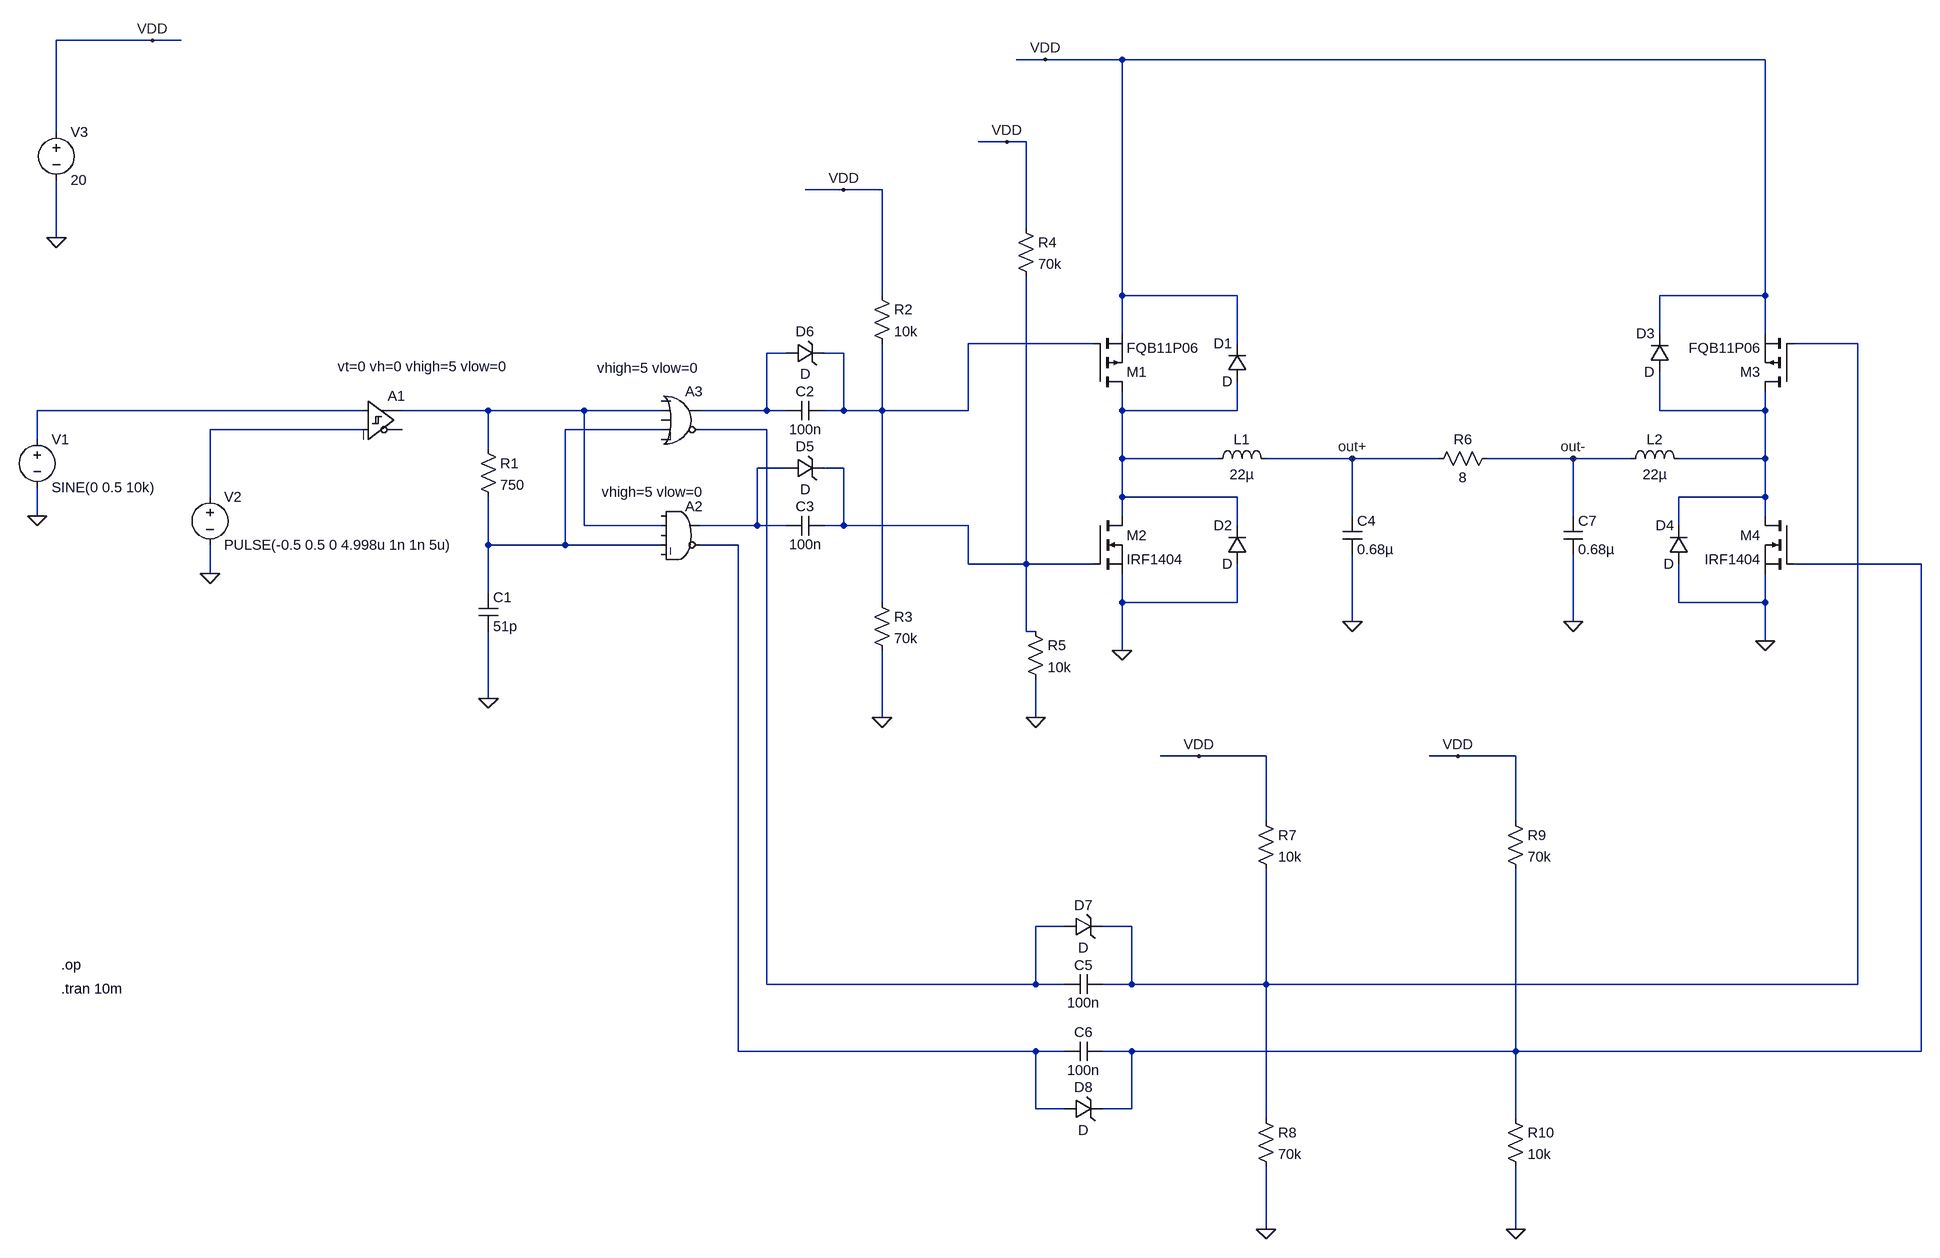
[diagram p0: schematic ClassDAmplifierFullWithProtection.asc]
ClassDAmplifierFullWithProtection.asc, the LTspice schematic file:
Version 4
SHEET 1 1620 1204
WIRE -1440 -880 -1600 -880
WIRE -1392 -880 -1440 -880
WIRE 48 -848 0 -848
WIRE 176 -848 48 -848
WIRE 1248 -848 176 -848
WIRE -1600 -720 -1600 -880
WIRE -16 -704 -64 -704
WIRE 16 -704 -16 -704
WIRE -288 -624 -352 -624
WIRE -224 -624 -288 -624
WIRE 16 -560 16 -704
WIRE -1600 -544 -1600 -640
WIRE -224 -448 -224 -624
WIRE 176 -448 176 -848
WIRE 368 -448 176 -448
WIRE 1248 -448 1248 -848
WIRE 1248 -448 1072 -448
WIRE 176 -384 176 -448
WIRE 1072 -384 1072 -448
WIRE 1248 -384 1248 -448
WIRE 128 -368 -80 -368
WIRE 368 -368 368 -448
WIRE 1504 -368 1296 -368
WIRE -384 -352 -416 -352
WIRE -288 -352 -320 -352
WIRE -1088 -256 -1632 -256
WIRE -880 -256 -1024 -256
WIRE -720 -256 -880 -256
WIRE -592 -256 -720 -256
WIRE -416 -256 -416 -352
WIRE -416 -256 -528 -256
WIRE -384 -256 -416 -256
WIRE -288 -256 -288 -352
WIRE -288 -256 -320 -256
WIRE -224 -256 -224 -368
WIRE -224 -256 -288 -256
WIRE -80 -256 -80 -368
WIRE -80 -256 -224 -256
WIRE 176 -256 176 -288
WIRE 368 -256 368 -304
WIRE 368 -256 176 -256
WIRE 1072 -256 1072 -320
WIRE 1248 -256 1248 -288
WIRE 1248 -256 1072 -256
WIRE -1088 -224 -1344 -224
WIRE -592 -224 -752 -224
WIRE -416 -224 -528 -224
WIRE -1632 -208 -1632 -256
WIRE -880 -192 -880 -256
WIRE 176 -176 176 -256
WIRE 336 -176 176 -176
WIRE 560 -176 416 -176
WIRE 704 -176 560 -176
WIRE 928 -176 784 -176
WIRE 1024 -176 928 -176
WIRE 1248 -176 1248 -256
WIRE 1248 -176 1104 -176
WIRE -384 -160 -432 -160
WIRE -288 -160 -320 -160
WIRE -1344 -112 -1344 -224
WIRE 176 -112 176 -176
WIRE 368 -112 176 -112
WIRE 1248 -112 1248 -176
WIRE 1248 -112 1104 -112
WIRE -1632 -80 -1632 -128
WIRE 176 -80 176 -112
WIRE 560 -80 560 -176
WIRE 928 -80 928 -176
WIRE 1248 -80 1248 -112
WIRE -720 -64 -720 -256
WIRE -592 -64 -720 -64
WIRE -432 -64 -432 -160
WIRE -432 -64 -528 -64
WIRE -384 -64 -432 -64
WIRE -288 -64 -288 -160
WIRE -288 -64 -320 -64
WIRE -80 -64 -288 -64
WIRE 368 -64 368 -112
WIRE 1104 -64 1104 -112
WIRE -880 -32 -880 -112
WIRE -752 -32 -752 -224
WIRE -752 -32 -880 -32
WIRE -592 -32 -752 -32
WIRE -464 -32 -528 -32
WIRE -80 0 -80 -64
WIRE 16 0 16 -480
WIRE 16 0 -80 0
WIRE 128 0 16 0
WIRE 1616 0 1296 0
WIRE -1344 16 -1344 -32
WIRE -880 48 -880 -32
WIRE -224 64 -224 -256
WIRE 176 64 176 16
WIRE 368 64 368 0
WIRE 368 64 176 64
WIRE 1104 64 1104 0
WIRE 1248 64 1248 16
WIRE 1248 64 1104 64
WIRE 560 96 560 -16
WIRE 928 96 928 -16
WIRE 16 112 16 0
WIRE 32 112 16 112
WIRE 1248 128 1248 64
WIRE 176 144 176 64
WIRE -880 224 -880 112
WIRE -224 256 -224 144
WIRE 32 256 32 192
WIRE 304 320 240 320
WIRE 416 320 304 320
WIRE 736 320 688 320
WIRE 832 320 736 320
WIRE 416 480 416 320
WIRE 832 480 832 320
WIRE 80 656 32 656
WIRE 192 656 144 656
WIRE -416 752 -416 -224
WIRE 32 752 32 656
WIRE 32 752 -416 752
WIRE 80 752 32 752
WIRE 192 752 192 656
WIRE 192 752 144 752
WIRE 416 752 416 560
WIRE 416 752 192 752
WIRE 1504 752 1504 -368
WIRE 1504 752 416 752
WIRE -464 864 -464 -32
WIRE 32 864 -464 864
WIRE 80 864 32 864
WIRE 192 864 144 864
WIRE 832 864 832 560
WIRE 832 864 192 864
WIRE 1616 864 1616 0
WIRE 1616 864 832 864
WIRE 32 960 32 864
WIRE 80 960 32 960
WIRE 192 960 192 864
WIRE 192 960 144 960
WIRE 416 976 416 752
WIRE 832 976 832 864
WIRE 416 1184 416 1056
WIRE 832 1184 832 1056
FLAG -1344 16 0
FLAG -1632 -80 0
FLAG -880 224 0
FLAG -1600 -544 0
FLAG -1440 -880 VDD
FLAG 176 144 0
FLAG 48 -848 VDD
FLAG 32 256 0
FLAG -224 256 0
FLAG -288 -624 VDD
FLAG -16 -704 VDD
FLAG 560 96 0
FLAG 928 96 0
FLAG 1248 128 0
FLAG 416 1184 0
FLAG 832 1184 0
FLAG 304 320 VDD
FLAG 736 320 VDD
FLAG 560 -176 out+
FLAG 928 -176 out-
SYMBOL Digital\\diffschmitt -1088 -304 R0
WINDOW 3 -43 -25 Left 2
SYMATTR Value vt=0 vh=0 vhigh=5 vlow=0
SYMATTR InstName A1
SYMBOL voltage -1632 -224 R0
WINDOW 123 0 0 Left 0
WINDOW 39 0 0 Left 0
SYMATTR InstName V1
SYMATTR Value SINE(0 0.5 10k)
SYMBOL voltage -1344 -128 R0
WINDOW 123 0 0 Left 0
WINDOW 39 0 0 Left 0
SYMATTR InstName V2
SYMATTR Value PULSE(-0.5 0.5 0 4.998u 1n 1n 5u)
SYMBOL Digital\\and -560 -112 R0
WINDOW 3 -131 -8 Left 2
SYMATTR Value vhigh=5 vlow=0
SYMATTR InstName A2
SYMBOL Digital\\or -560 -304 R0
WINDOW 3 -139 -23 Left 2
SYMATTR Value vhigh=5 vlow=0
SYMATTR InstName A3
SYMBOL res -896 -208 R0
SYMATTR InstName R1
SYMATTR Value 750
SYMBOL cap -896 48 R0
SYMATTR InstName C1
SYMATTR Value 51p
SYMBOL voltage -1600 -736 R0
WINDOW 123 0 0 Left 0
WINDOW 39 0 0 Left 0
SYMATTR InstName V3
SYMATTR Value 20
SYMBOL cap -320 -272 R90
WINDOW 0 0 32 VBottom 2
WINDOW 3 32 32 VTop 2
SYMATTR InstName C2
SYMATTR Value 100n
SYMBOL cap -320 -80 R90
WINDOW 0 0 32 VBottom 2
WINDOW 3 32 32 VTop 2
SYMATTR InstName C3
SYMATTR Value 100n
SYMBOL pmos 128 -288 M180
SYMATTR InstName M1
SYMATTR Value FQB11P06
SYMBOL nmos 128 -80 R0
SYMATTR InstName M2
SYMATTR Value IRF1404
SYMBOL res -240 -464 R0
SYMATTR InstName R2
SYMATTR Value 10k
SYMBOL res -240 48 R0
SYMATTR InstName R3
SYMATTR Value 70k
SYMBOL res 0 -576 R0
SYMATTR InstName R4
SYMATTR Value 70k
SYMBOL res 16 96 R0
SYMATTR InstName R5
SYMATTR Value 10k
SYMBOL ind 320 -160 R270
WINDOW 0 32 56 VTop 2
WINDOW 3 5 56 VBottom 2
SYMATTR InstName L1
SYMATTR Value 22µ
SYMBOL cap 544 -80 R0
SYMATTR InstName C4
SYMATTR Value 0.68µ
SYMBOL res 800 -192 R90
WINDOW 0 0 56 VBottom 2
WINDOW 3 32 56 VTop 2
SYMATTR InstName R6
SYMATTR Value 8
SYMBOL diode 384 -304 R180
WINDOW 0 24 64 Left 2
WINDOW 3 24 0 Left 2
SYMATTR InstName D1
SYMBOL diode 384 0 R180
WINDOW 0 24 64 Left 2
WINDOW 3 24 0 Left 2
SYMATTR InstName D2
SYMBOL cap 144 736 R90
WINDOW 0 0 32 VBottom 2
WINDOW 3 32 32 VTop 2
SYMATTR InstName C5
SYMATTR Value 100n
SYMBOL cap 144 848 R90
WINDOW 0 0 32 VBottom 2
WINDOW 3 32 32 VTop 2
SYMATTR InstName C6
SYMATTR Value 100n
SYMBOL pmos 1296 -288 R180
SYMATTR InstName M3
SYMATTR Value FQB11P06
SYMBOL cap 912 -80 R0
SYMATTR InstName C7
SYMATTR Value 0.68µ
SYMBOL ind 1008 -160 R270
WINDOW 0 32 56 VTop 2
WINDOW 3 5 56 VBottom 2
SYMATTR InstName L2
SYMATTR Value 22µ
SYMBOL nmos 1296 -80 M0
SYMATTR InstName M4
SYMATTR Value IRF1404
SYMBOL res 400 464 R0
SYMATTR InstName R7
SYMATTR Value 10k
SYMBOL res 400 960 R0
SYMATTR InstName R8
SYMATTR Value 70k
SYMBOL res 816 464 R0
SYMATTR InstName R9
SYMATTR Value 70k
SYMBOL res 816 960 R0
SYMATTR InstName R10
SYMATTR Value 10k
SYMBOL diode 1088 -320 R180
WINDOW 0 24 64 Left 2
WINDOW 3 24 0 Left 2
SYMATTR InstName D3
SYMBOL diode 1120 0 R180
WINDOW 0 24 64 Left 2
WINDOW 3 24 0 Left 2
SYMATTR InstName D4
SYMBOL zener -384 -144 R270
WINDOW 0 36 32 VTop 2
WINDOW 3 -4 32 VBottom 2
SYMATTR InstName D5
SYMBOL zener -384 -336 R270
WINDOW 0 36 32 VTop 2
WINDOW 3 -4 32 VBottom 2
SYMATTR InstName D6
SYMBOL zener 80 672 R270
WINDOW 0 36 32 VTop 2
WINDOW 3 -4 32 VBottom 2
SYMATTR InstName D7
SYMBOL zener 80 976 R270
WINDOW 0 36 32 VTop 2
WINDOW 3 -4 32 VBottom 2
SYMATTR InstName D8
TEXT -1592 720 Left 2 !.op
TEXT -1592 760 Left 2 !.tran 10m

The netlist it stands for:
* ClassDAmplifierFullWithProtection.asc
A1 N004 N008 0 0 0 0 N005 0 SCHMITT vt=0 vh=0 vhigh=5 vlow=0
V1 N004 0 SINE(0 0.5 10k)
V2 N008 0 PULSE(-0.5 0.5 0 4.998u 1n 1n 5u)
A2 0 N005 0 N009 0 N013 N011 0 AND vhigh=5 vlow=0
A3 0 N005 0 N009 0 N010 N003 0 OR vhigh=5 vlow=0
R1 N005 N009 750
C1 N009 0 51p
V3 VDD 0 20
C2 N001 N003 100n
C3 N012 N011 100n
M1 N006 N001 VDD VDD FQB11P06
M2 N006 N012 0 0 IRF1404
R2 VDD N001 10k
R3 N001 0 70k
R4 VDD N012 70k
R5 N012 0 10k
L1 N006 out+ 22µ
C4 out+ 0 0.68µ
R6 out- out+ 8
D1 N006 VDD D
D2 0 N006 D
C5 N002 N010 100n
C6 N014 N013 100n
M3 N007 N002 VDD VDD FQB11P06
C7 out- 0 0.68µ
L2 out- N007 22µ
M4 N007 N014 0 0 IRF1404
R7 VDD N002 10k
R8 N002 0 70k
R9 VDD N014 70k
R10 N014 0 10k
D3 N007 VDD D
D4 0 N007 D
D5 N011 N012 D
D6 N003 N001 D
D7 N010 N002 D
D8 N013 N014 D
.model D D
.lib standard.dio
.model NMOS NMOS
.model PMOS PMOS
.lib standard.mos
.op
.tran 10m
.backanno
.end